# Altium project miniAwtrix.PrjPcb
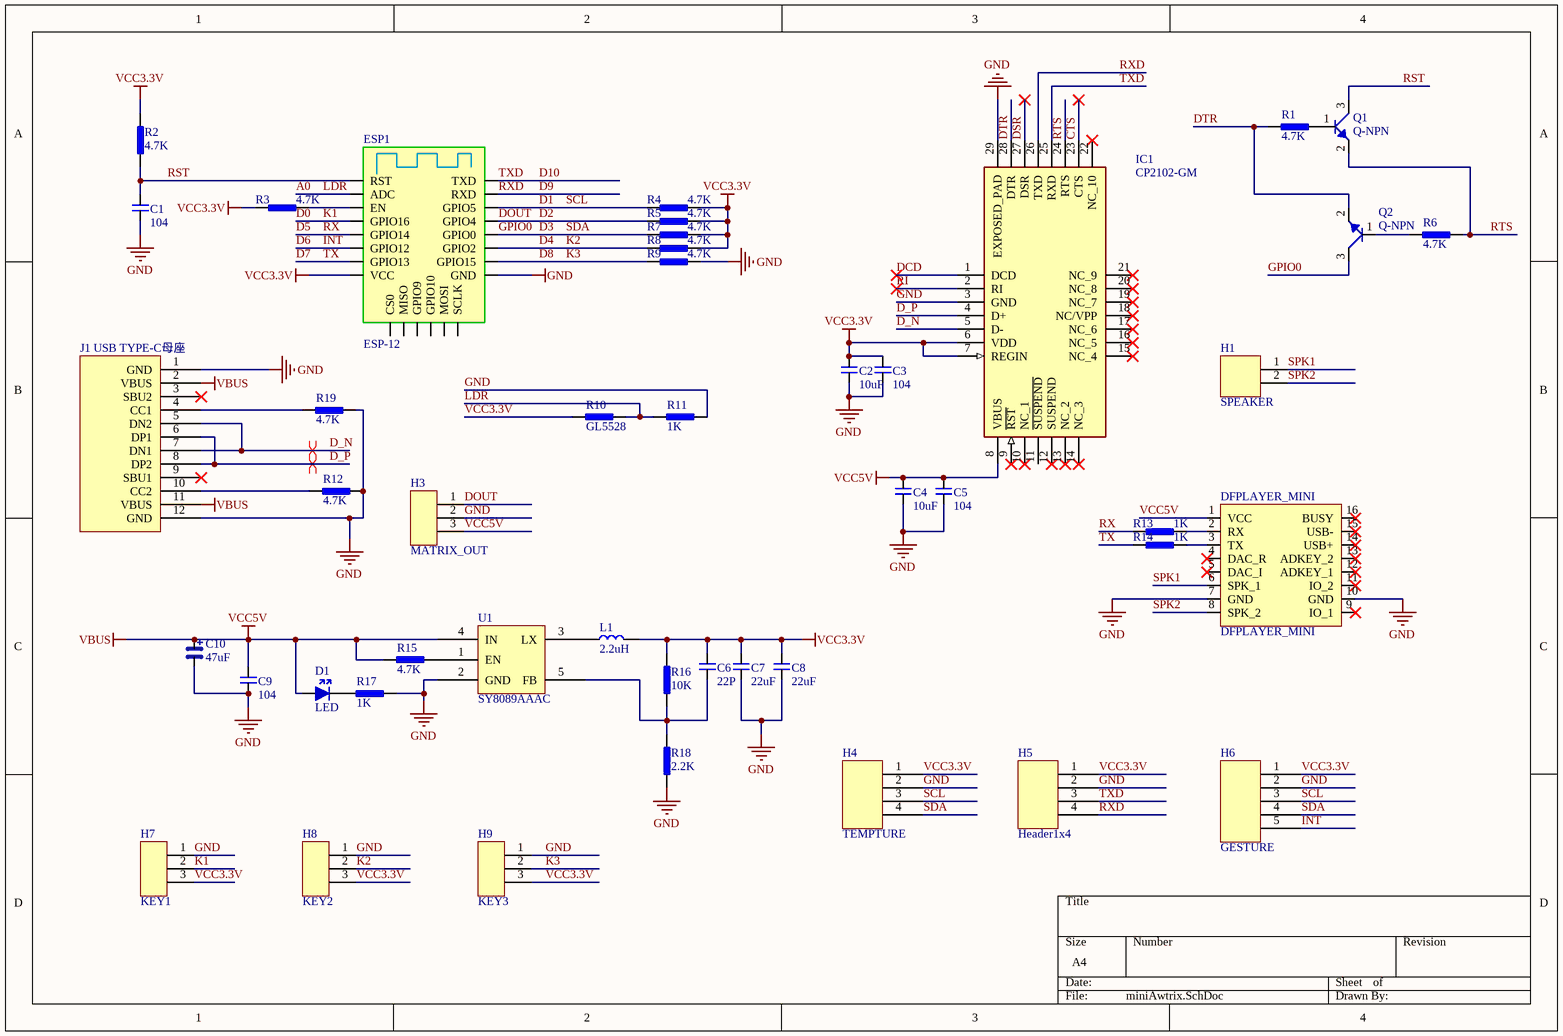
[diagram p0: miniAwtrix.SchDoc]
1 sheet, 46 parts. Net scope: global (net labels, ports and power ports of the same name join across sheets).
Board file: miniAWTRIX.PcbDoc

## Sheet miniAwtrix.SchDoc
size A4

### Parts
C1  104  [C0805]
C2  10uF  [C0805]
C3  104  [C0805]
C4  10uF  [C0805]
C5  104  [C0805]
C6  22P  [C0805]
C7  22uF  [C0805]
C8  22uF  [C0805]
C9  104  [C0805]
C10  47uF  [TAN-3528]
D1  LED  [LED0805]
DFPLAYER_MINI  DFPLAYER_MINI  [DFPLAYER-MINI]
ESP1  ESP-12  [ESP12F - duplicate]
H1  SPEAKER  [HDR1X2_2.54]
H3  MATRIX_OUT  [HDR1X3]
H4  TEMPTURE  [HDR1X4_2.54]
H5  Header1x4  [HDR1X4_2.54]
H6  GESTURE  [HDR1X5_2.54]
H7  KEY1  [HDR1X3_2.54]
H8  KEY2  [HDR1X3_2.54]
H9  KEY3  [HDR1X3_2.54]
IC1  CP2102-GM  [QFN50P500X500X100-29N-D]
J1  USB TYPE-C母座  [USB-TYPEC-SMT]
L1  2.2uH  [L-CDR5*5]
Q1  Q-NPN  [SOT-23]
Q2  Q-NPN  [SOT-23]
R1  4.7K  [R0805]
R2  4.7K  [R0805]
R3  4.7K  [R0805]
R4  4.7K  [R0805]
R5  4.7K  [R0805]
R6  4.7K  [R0805]
R7  4.7K  [R0805]
R8  4.7K  [R0805]
R9  4.7K  [R0805]
R10  GL5528  [HDR1X2_2.54]
R11  1K  [R0805]
R12  4.7K  [R0805]
R13  1K  [R0805]
R14  1K  [R0805]
R15  4.7K  [R0805]
R16  10K  [R0805]
R17  1K  [R0805]
R18  2.2K  [R0805]
R19  4.7K  [R0805]
U1  SY8089AAAC  [SOT-23-5]

### Nets
GND: C1.1 C2.1 C3.1 C4.1 C5.1 C7.1 C8.1 C9.1 C10.2 DFPLAYER_MINI.7(GND) DFPLAYER_MINI.10(GND) ESP1.15(GND) H3.2 H4.2 H5.2 H6.2 H7.1 H8.1 H9.1 IC1.3(GND) IC1.29(EXPOSED_PAD) J1.1(GND) J1.12(GND) R9.2 R11.2 R12.2 R17.2 R18.1 R19.2 U1.2(GND)
VCC3.3V: C2.2 C3.2 C6.2 C7.2 C8.2 ESP1.8(VCC) H4.1 H5.1 H6.1 H7.3 H8.3 H9.3 IC1.6(VDD) IC1.7(REGIN) L1.1 R2.2 R3.1 R4.2 R5.2 R7.2 R8.2 R10.1 R16.2
VCC5V: C4.2 C5.2 C9.2 C10.1 D1.1 DFPLAYER_MINI.1(VCC) H3.3 IC1.8(VBUS) J1.2(VBUS) J1.11(VBUS) R15.1 U1.4(IN)  [also labelled VBUS]
A0: ESP1.2(ADC) R10.2 R11.1  [also labelled LDR]
CTS: IC1.23(CTS)
D0: ESP1.4(GPIO16) H7.2  [also labelled K1]
D1: ESP1.20(GPIO5) H4.3 H6.3 R4.1  [also labelled SCL]
D2: ESP1.19(GPIO4) H3.1 R5.1  [also labelled DOUT]
D3: ESP1.18(GPIO0) H4.4 H6.4 Q2.3 R7.1  [also labelled GPIO0, SDA]
D4: ESP1.17(GPIO2) H8.2 R8.1  [also labelled K2]
D5: ESP1.5(GPIO14) R13.1  [also labelled RX]
D6: ESP1.6(GPIO12) H6.5  [also labelled INT]
D7: ESP1.7(GPIO13) R14.1  [also labelled TX]
D8: ESP1.16(GPIO15) H9.2 R9.1  [also labelled K3]
D9: ESP1.21(RXD) H5.4 IC1.26(TXD)  [also labelled RXD]
D10: ESP1.22(TXD) H5.3 IC1.25(RXD)  [also labelled TXD]
D_N: IC1.5(D-) J1.5(DN2) J1.7(DN1)
D_P: IC1.4(D+) J1.6(DP1) J1.8(DP2)
DCD: IC1.1(DCD)
DSR: IC1.27(DSR)
DTR: IC1.28(DTR) Q2.2 R1.1
RI: IC1.2(RI)
RST: C1.2 ESP1.1(RST) Q1.3 R2.1
RTS: IC1.24(RTS) Q1.2 R6.2
SPK1: DFPLAYER_MINI.6(SPK_1) H1.1
SPK2: DFPLAYER_MINI.8(SPK_2) H1.2
NetC6_1: C6.1 R16.1 R18.2 U1.5(FB)
NetD1_2: D1.2 R17.1
NetDFPLAYER_MINI_2: DFPLAYER_MINI.2(RX) R13.2
NetDFPLAYER_MINI_3: DFPLAYER_MINI.3(TX) R14.2
NetESP1_3: ESP1.3(EN) R3.2
NetJ1_4: J1.4(CC1) R19.1
NetJ1_10: J1.10(CC2) R12.1
NetL1_2: L1.2 U1.3(LX)
NetQ1_1: Q1.1 R1.2
NetQ2_1: Q2.1 R6.1
NetR15_2: R15.2 U1.1(EN)

Not connected (* = marked no-connect by the designer): DFPLAYER_MINI 4(DAC_R)* 5(DAC_I)* 9(IO_1)* 11(IO_2)* 12(ADKEY_1)* 13(ADKEY_2)* 14(USB+)* 15(USB-)* 16(BUSY)*; ESP1 9(CS0) 10(MISO) 11(GPIO9) 12(GPIO10) 13(MOSI) 14(SCLK); IC1 9(~{RST})* 10(NC_1)* 11(~{SUSPEND}) 12(SUSPEND)* 13(NC_2)* 14(NC_3)* 15(NC_4)* 16(NC_5)* 17(NC_6)* 18(NC/VPP)* 19(NC_7)* 20(NC_8)* 21(NC_9)* 22(NC_10)*; J1 3(SBU2)* 9(SBU1)*

### Layout directives
differential pair: D_N, D_P

### Library data of the parts
C1-C9 = CAP
C10 = C-TAN: 钽电容
ESP1 = ESP12F
H1 = Header1x2
H3 H7-H9 = Header1x3
H4 = Header1x4
H6 = Header1x5
IC1 = CP2102-GM: Integrated Circuit; Manufacturer_Name: Silicon Labs; Allied_Number: R1015739; Datasheet Link: http://docs-emea.rs-online.com/webdocs/065a/0900766b8065a805.pdf; Height: 1mm; Manufacturer_Part_Number: CP2102-GM; Mouser Part Number: 634-CP2102-GM; Mouser Price/Stock: https://www.mouser.com/Search/Refine.aspx?Keyword=634-CP2102-GM; RS Part Number: 5268841; RS Price/Stock: https://uk.rs-online.com/web/p/products/5268841; Allied Price/Stock: http://www.alliedelec.com/silicon-laboratories-cp2102-gm/R1015739/
J1 = USB TYPE-C
L1 = Inductance
R1-R19 = RES